# Altium schematic sheet Relay.SchDoc
size A4
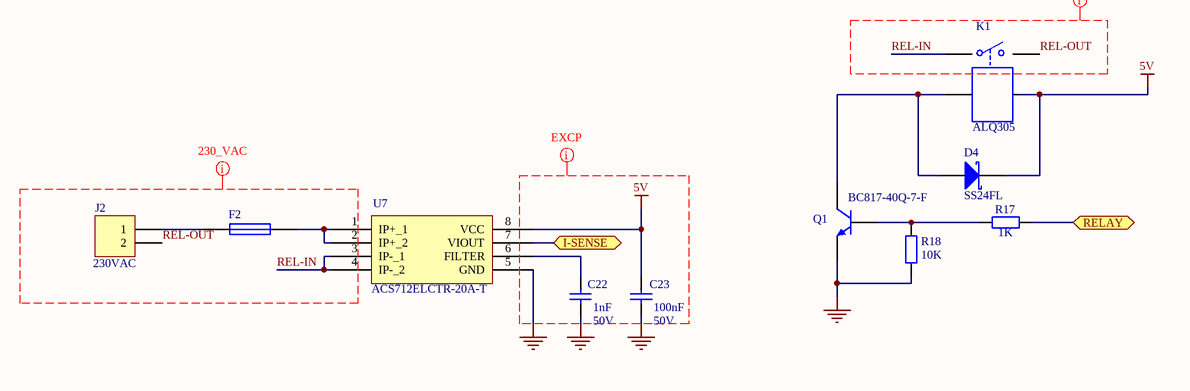
[diagram p0: Relay.SchDoc]

## Parts
C22  Value 1: 1nF  Value 2: 50V  [CAPC1608N]  (hidden comment: Capacitor)
C23  Value 1: 100nF  Value 2: 50V  [CAPC1608N]  (hidden comment: Capacitor)
D4  SS24FL  [SOD-123F]
F2  0031.8001  [SCHURTER_0031.8201]  (value not drawn)
J2  230VAC  [CUI_TB007-508-02BE]
K1  ALQ305  [ALQ305]
Q1  BC817-40Q-7-F  [SOT23-3N]
R17  Value 1: 1K  [RESC1608N]  (hidden comment: Resistor)
R18  Value 1: 10K  [RESC1608N]  (hidden comment: Resistor)
U7  ACS712ELCTR-20A-T  [SOIC127P600X175-8N]

## Ports
I-SENSE (bidir), RELAY (bidir)

## Nets
5V: C23.2 D4.2(K) K1.1(COIL_1) U7.8(VCC)
GND: C22.1 C23.1 Q1.3(E) R18.1 U7.5(GND)
I-SENSE: U7.7(VIOUT) ; port I-SENSE
REL-IN: K1.3(COM) U7.3(IP-_1) U7.4(IP-_2)
REL-OUT: J2.2 K1.2(NO)
RELAY: R17.2 ; port RELAY
NetC22_2: C22.2 U7.6(FILTER)
NetD4_1: D4.1(A) K1.4(COIL_2) Q1.2(C)
NetF2_1: F2.1 J2.1
NetF2_2: F2.2 U7.1(IP+_1) U7.2(IP+_2)
NetQ1_1: Q1.1(B) R17.1 R18.2

## Layout directives
net class 230_VAC: REL-IN, REL-OUT
net class EXCP: 5V, GND

## Library data of the parts
C22 = CAP-000000010: MAN: MULTICOMP; MANREF: MC0603B102K500CT; DES: MC0603B102K500CT -  Condensateur céramique multicouche CMS, 0603 [1608 Metric], 1000 pF, 50 V, ± 10%, X7R, Série MC; TOL: 10%; FTP: 0603; SUP: Farnell; SUPREF: 1759088; NOTE: _; Part Number: CAP-000000010
C23 = CAP-000000002: MAN: VISHAY; MANREF: VJ0603V104ZXAPW1BC; DES: VJ0603V104ZXAPW1BC -  Condensateur céramique multicouche CMS, 0.1 µF, 50 V, 0603 [1608 Metric], +80%, -20%, Y5V; TOL: +80% -20%; FTP: 0603; SUP: Farnell; SUPREF: 2896408; NOTE: _; Part Number: CAP-000000002
D4 = DIS-000000002: MAN: ON Semiconductor / Fairchild; DES: Schottky Diodes & Rectifiers 40V, 2A SCHOTTKY; Value 1: 2A; Value 2: 40V; TOL: _; FTP: SOD-123-2; SUP: Mouser; SUPREF: 512-SS24FL; Part Number: DIS-000000002; MANREF: SS24FL; NOTE: _
F2 = FUS-000000001: MAN: Schurter; DES: Fuse Holder OG FUSEHOLDER 5X20; Value 1: 10A; Value 2: 600V; TOL: _; SUP: Mouser; SUPREF: 693-0031.8001; Part Number: FUS-000000001; MANREF: 0031.8001; FTP: _; NOTE: _
J2 = CON-000000001: MAN: CUI Devices; MANREF: TB007-508-02BE / 39910-0102; DES: Fixed Terminal Blocks Terminal block, screw type, 5.08 , horizontal, 2 poles, CUI Blue, slotted screw, PCB mount; Value 1: 2pts; Value 2: 5.08 mm; TOL: _; FTP: THT; SUP: Mouser; SUPREF: 490-TB007-508-02BE; Part Number: CON-000000001; NOTE: _
K1 = SWC-000000003: MAN: Panasonic Industrial Devices; DES: General Purpose Relays LQ Relay; Value 1: 10 A; Value 2: 5 VDC; SUP: Mouser; SUPREF: 769-ALQ305; NOTE: _; Part Number: SWC-000000003; MANREF: ALQ305
Q1 = TRP-000000001: MAN: Diodes Incorporated; DES: Bipolar Transistors - BJT SS Low Sat Transistor; Value 1: 0.5A; Value 2: 45V; TOL: _; FTP: SOT-23; SUP: Mouser; SUPREF: 621-BC817-40Q-7-F; Part Number: TRP-000000001; MANREF: BC817-40Q-7-F; NOTE: _
R17 = RES-000000006: MAN: TE Connectivity / Neohm; MANREF: CPF0603F1K0C1; DES: Thin Film Resistors - SMD 1KOhm .063W 50PPM; Value 2: 0.625W; TOL: 1%; FTP: 0603; SUP: Mouser; SUPREF: 279-CPF0603F1K0C1; NOTE: _; Part Number: RES-000000006
R18 = RES-000000001: MAN: YAGEO; MANREF: RC0603FR-0710KL; DES: YAGEO (PHYCOMP)  RC0603FR-0710KL  RESISTANCE COUCHE EPAISSE 10K 0.1W 1%; Value 2: 0.1W; TOL: 1%; FTP: 0603; SUP: Farnell; SUPREF: 9238603; NOTE: _; Part Number: RES-000000001
U7 = SEN-000000001: MAN: ALLEGRO MICROSYSTEMS; DES: ACS712ELCTR-20A-T -  Capteur de courant linéaire, Effet Hall, +/- 20A, SOIC-8; Value 1: 20A; Value 2: 5V; TOL: _; FTP: SOIC-8; SUP: Farnell; SUPREF: 1329624RL; Part Number: SEN-000000001; MANREF: ACS712ELCTR-20A-T; NOTE: _